# Altium schematic sheet MPU6050.SchDoc
size A3; SheetNumber: 3; SheetTotal: 6
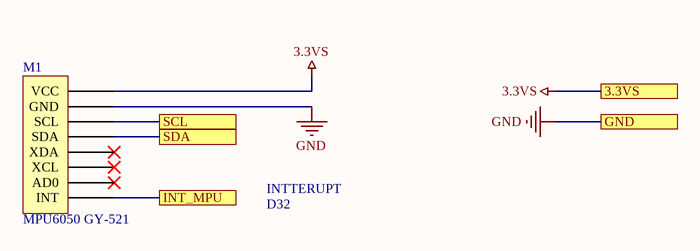
[diagram p0: MPU6050.SchDoc]

## Parts
M1  MPU6050 GY-521  [MPU6050 GY-521]

## Ports
3.3VS, GND, INT_MPU, SCL, SDA

## Nets
3.3VS: M1.1(VCC) ; port 3.3VS
GND: M1.2(GND) ; port GND
INT_MPU: M1.8(INT) ; port INT_MPU
SCL: M1.3(SCL) ; port SCL
SDA: M1.4(SDA) ; port SDA

Not connected (* = marked no-connect by the designer): M1 5(XDA)* 6(XCL)* 7(AD0)*

## Notes on the sheet
- INTTERUPT
- D32

## Library data of the parts
M1 = MPU6050 GY-521: Module